# Altium schematic sheet Relays.SchDoc
size A3
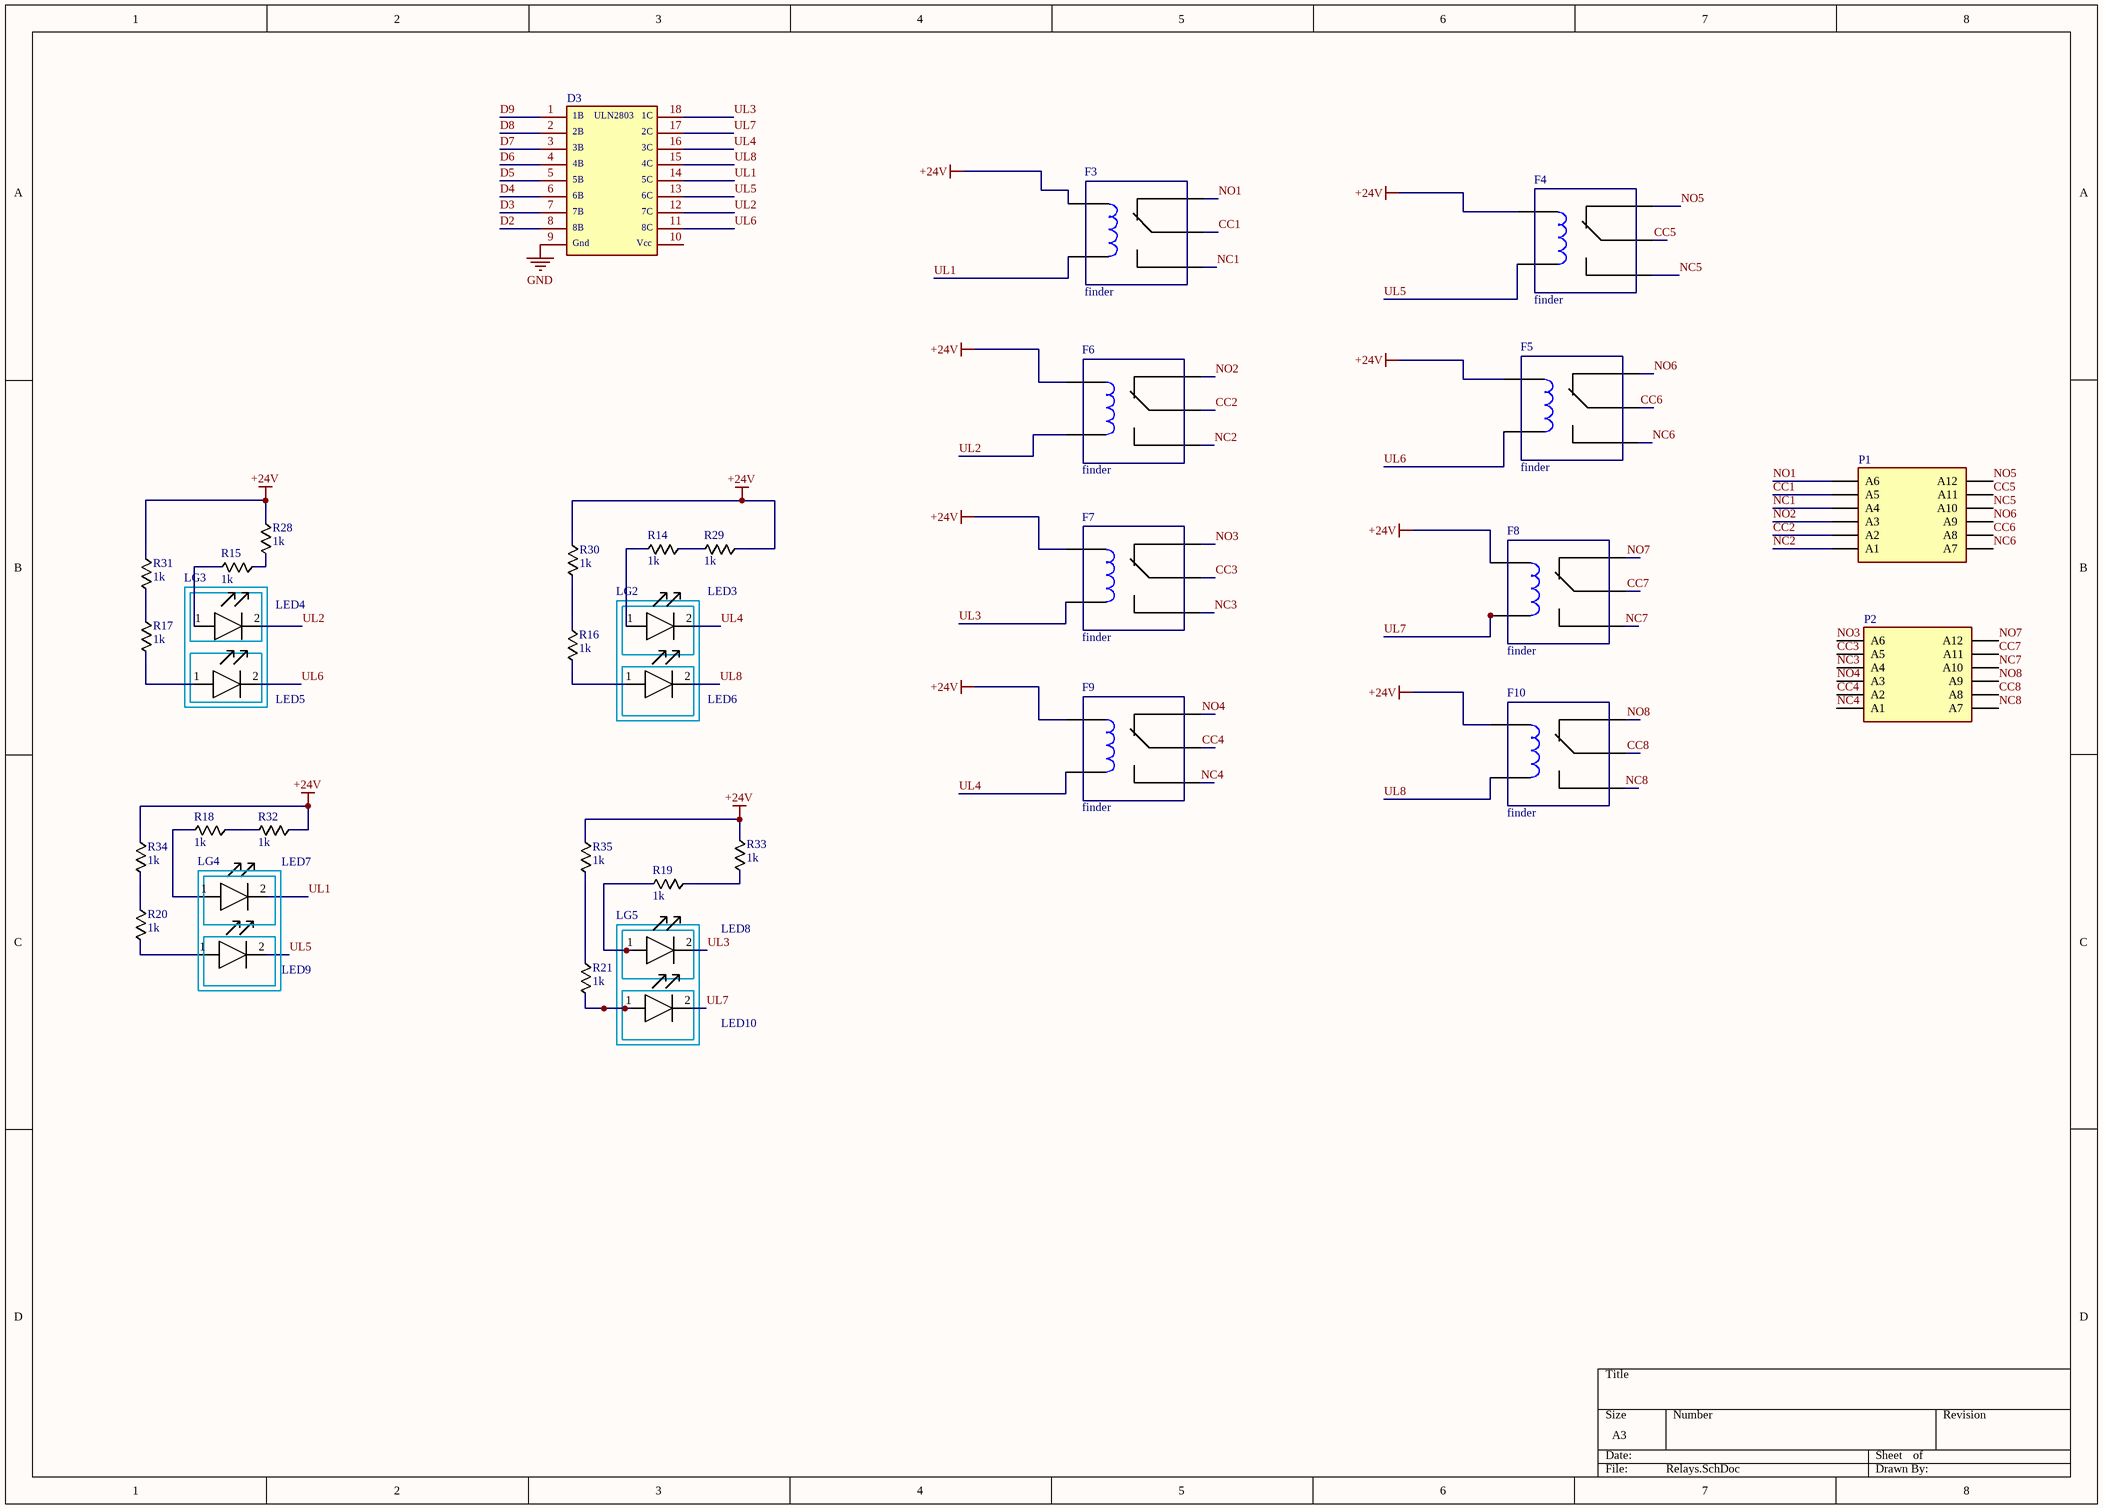
[diagram p0: Relays.SchDoc]

## Parts
D3  (no value)  [SOIC 18]
F3  finder  [413190240010]
F4  finder  [413190240010]
F5  finder  [413190240010]
F6  finder  [413190240010]
F7  finder  [413190240010]
F8  finder  [413190240010]
F9  finder  [413190240010]
F10  finder  [413190240010]
LED3  (no value)  [0603 - LED]
LED4  (no value)  [0603 - LED]
LED5  (no value)  [0603 - LED]
LED6  (no value)  [0603 - LED]
LED7  (no value)  [0603 - LED]
LED8  (no value)  [0603 - LED]
LED9  (no value)  [0603 - LED]
LED10  (no value)  [0603 - LED]
LG2  (no value)  [LED SMD DayLight]
LG3  (no value)  [LED SMD DayLight]
LG4  (no value)  [LED SMD DayLight]
LG5  (no value)  [LED SMD DayLight]
P1  (no value)  [mcd 1,5/6-G1-3.81]
P2  (no value)  [mcd 1,5/6-G1-3.81]
R14  1k  [0603_Res]
R15  1k  [0603_Res]
R16  1k  [0603_Res]
R17  1k  [0603_Res]
R18  1k  [0603_Res]
R19  1k  [0603_Res]
R20  1k  [0603_Res]
R21  1k  [0603_Res]
R28  1k  [0603_Res]
R29  1k  [0603_Res]
R30  1k  [0603_Res]
R31  1k  [0603_Res]
R32  1k  [0603_Res]
R33  1k  [0603_Res]
R34  1k  [0603_Res]
R35  1k  [0603_Res]

## Nets
+24V: F3.A2 F4.A2 F5.A2 F6.A2 F7.A2 F8.A2 F9.A2 F10.A2 R28.1 R29.1 R30.1 R31.1 R32.1 R33.1 R34.1 R35.1
GND: D3.9
CC1: F3.11 P1.3(A5)
CC2: F6.11 P1.9(A2)
CC3: F7.11 P2.3(A5)
CC4: F9.11 P2.9(A2)
CC5: F4.11 P1.4(A11)
CC6: F5.11 P1.10(A8)
CC7: F8.11 P2.4(A11)
CC8: F10.11 P2.10(A8)
D2: D3.8
D3: D3.7
D4: D3.6
D5: D3.5
D6: D3.4
D7: D3.3
D8: D3.2
D9: D3.1
NC1: F3.14 P1.5(A4)
NC2: F6.14 P1.11(A1)
NC3: F7.14 P2.5(A4)
NC4: F9.14 P2.11(A1)
NC5: F4.14 P1.6(A10)
NC6: F5.14 P1.12(A7)
NC7: F8.14 P2.6(A10)
NC8: F10.14 P2.12(A7)
NO1: F3.12 P1.1(A6)
NO2: F6.12 P1.7(A3)
NO3: F7.12 P2.1(A6)
NO4: F9.12 P2.7(A3)
NO5: F4.12 P1.2(A12)
NO6: F5.12 P1.8(A9)
NO7: F8.12 P2.2(A12)
NO8: F10.12 P2.8(A9)
UL1: D3.14 F3.A1 LED7.2
UL2: D3.12 F6.A1 LED4.2
UL3: D3.18 F7.A1 LED8.2
UL4: D3.16 F9.A1 LED3.2
UL5: D3.13 F4.A1 LED9.2
UL6: D3.11 F5.A1 LED5.2
UL7: D3.17 F8.A1 LED10.2
UL8: D3.15 F10.A1 LED6.2
NetLED3_1: LED3.1 R14.2
NetLED4_1: LED4.1 R15.2
NetLED5_1: LED5.1 R17.2
NetLED6_1: LED6.1 R16.2
NetLED7_1: LED7.1 R18.2
NetLED8_1: LED8.1 R19.2
NetLED9_1: LED9.1 R20.2
NetLED10_1: LED10.1 R21.2
NetR14_1: R14.1 R29.2
NetR15_1: R15.1 R28.2
NetR16_1: R16.1 R30.2
NetR17_1: R17.1 R31.2
NetR18_1: R18.1 R32.2
NetR19_1: R19.1 R33.2
NetR20_1: R20.1 R34.2
NetR21_1: R21.1 R35.2

Not connected (* = marked no-connect by the designer): D3 10

## Notes on the sheet
- (in symbol ULN2803 Darlington_1) 1B; ULN2803; 1C; 2B; 2C; 3B; 3C; 4B; 4C; 5B; 5C; 6B; 6C; 7B; 7C; 8B; 8C; Gnd; Vcc

## Library data of the parts
D3 = ULN2803 Darlington_1: Part Description: Darlington Transistors Eight NPN Array; Part Number: ULN2803ADWR
F3 = finder: Part Description: General Purpose Relays; Part Number: G2RL124DC
F4-F10 = finder: G2RL124DC; Part Description: General Purpose Relays; Part Number: G2RL124DC
LED3-LED10 = LED 0603: Part Number: KP-1608SGC; Part Description: 0603 Single Colour LED Green
LG2-LG5 = Light Guide 2: Part Number: 5151094F; Part Description: Light Guide
P1 P2 = MCD 1.5/6 Phoenix: Part Description: Pluggable Terminal Blocks; LatestRevisionDate: 17-Jul-2002; LatestRevisionNote: Re-released for DXP Platform.; Publisher: Altium Limited; Part Number: MCD 1.5/6 Phoenix
R14-R21 R28-R35 = Resistor 0805: Part Description: Thick Film Resistor - 0603, 1kOhms, 1%, 1/10W; Part Number: RC0603FR-071KL